# Altium schematic sheet POWER.SchDoc
size A4; SheetNumber: 1; SheetTotal: 1
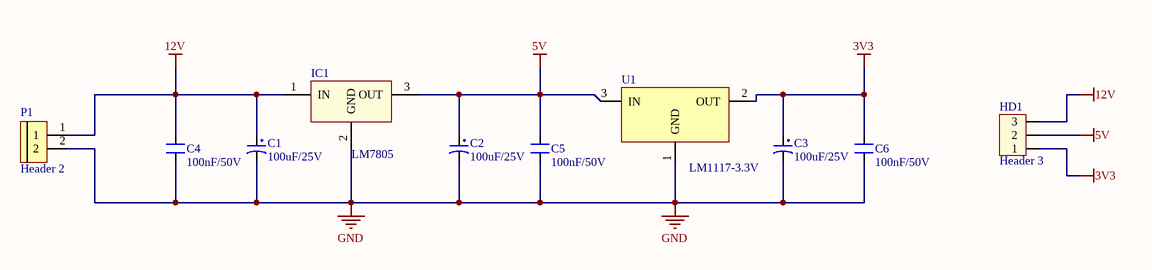
[diagram p0: POWER.SchDoc]

## Parts
C1  100uF/25V  [CP1.5/3.4]
C2  100uF/25V  [CP1.5/3.4]
C3  100uF/25V  [CP1.5/3.4]
C4  100nF/50V  [CN1.5]
C5  100nF/50V  [CN1.5]
C6  100nF/50V  [CN1.5]
HD1  Header 3  [HED3T]
IC1  LM7805  [QTO-220]
P1  Header 2  [BIG_Header 2]
U1  LM1117-3.3V  [SOT223-4N]

## Nets
3V3: C3.1 C6.2 HD1.1 U1.2(OUT)
5V: C2.1 C5.2 HD1.2 IC1.3(OUT) U1.3(IN)
12V: C1.1 C4.2 HD1.3 IC1.1(IN) P1.1
GND: C1.2 C2.2 C3.2 C4.1 C5.1 C6.1 IC1.2(GND) P1.2 U1.1(GND)

## Library data of the parts
C1-C3 = CP3: Cap 100uF/35V - 470uF/16V; Value: 100uF/35V/50V; Description 1: 1000uF/6,3V - 470uF/16V - 330uF - 25V; Description 2: 220uF/35V - 100uF/50V - 63V - 4,7uF/200V; Description 3: 22uF => 33uF100V - 3,3uF => 4,7uF/250V; Description 4: 2,2uF =>3,3uF/350 - 2,2uF/400V - 1uF/450V
C4-C6 = CN1.5: Cap np 682pF => 104pF; Value: 0.01uF
HD1 = Hed3: Header 3 (Green); Value: Header 3
IC1 = LM78xx: On ap +, from + 5 to + 24VDC; Value: LM7805
P1 = Header 2: Big Header 2
U1 = LM1117: 800mA Low-Dropout Linear Regulator; Creator: Nguyen Ba Bien; Website: http://group3i.net